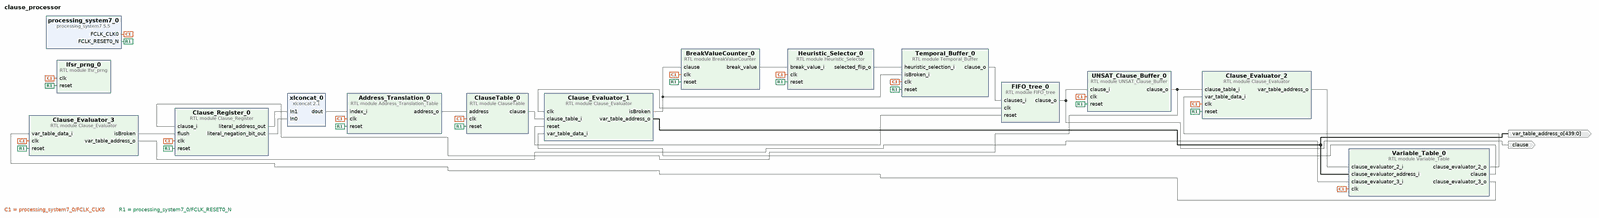
[diagram p0: block diagram of the top level, whole]
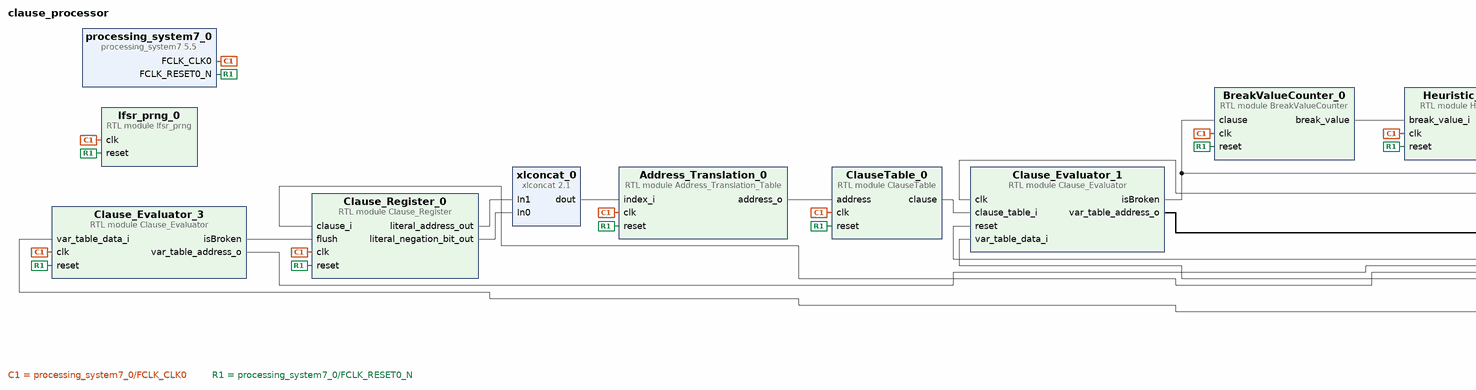
[diagram p1: block diagram of the top level, left part]
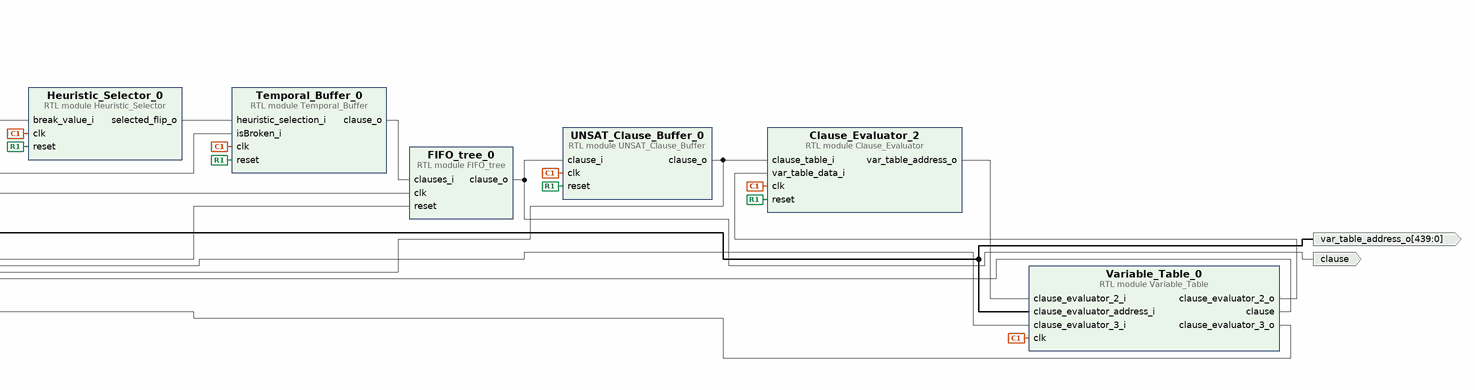
[diagram p2: block diagram of the top level, right part]
# Vivado block design clause_processor, xc7z020clg400-1, Vivado 2023.2
create_bd_design clause_processor

create_bd_port -dir O -from 439 -to 0 var_table_address_o
create_bd_port -dir O clause

create_bd_cell -type module -reference ClauseTable ClauseTable_0
create_bd_cell -type module -reference BreakValueCounter BreakValueCounter_0
create_bd_cell -type module -reference Clause_Evaluator Clause_Evaluator_1
create_bd_cell -type ip -vlnv xilinx.com:ip:processing_system7:5.5 processing_system7_0
create_bd_cell -type module -reference Heuristic_Selector Heuristic_Selector_0
create_bd_cell -type module -reference FIFO_tree FIFO_tree_0
create_bd_cell -type module -reference UNSAT_Clause_Buffer UNSAT_Clause_Buffer_0
create_bd_cell -type module -reference Variable_Table Variable_Table_0
create_bd_cell -type module -reference Clause_Register Clause_Register_0
create_bd_cell -type module -reference Clause_Evaluator Clause_Evaluator_2
set_property -dict {CONFIG.MAX_CLAUSES_PER_VARIABLE 1 CONFIG.NSAT 4} [get_bd_cells Clause_Evaluator_2]
create_bd_cell -type module -reference Clause_Evaluator Clause_Evaluator_3
set_property -dict {CONFIG.MAX_CLAUSES_PER_VARIABLE 1 CONFIG.NSAT 4} [get_bd_cells Clause_Evaluator_3]
create_bd_cell -type module -reference lfsr_prng lfsr_prng_0
create_bd_cell -type module -reference Address_Translation_Table Address_Translation_0
create_bd_cell -type ip -vlnv xilinx.com:ip:xlconcat:2.1 xlconcat_0
set_property -dict {CONFIG.IN0_WIDTH 1 CONFIG.IN1_WIDTH 11} [get_bd_cells xlconcat_0]
create_bd_cell -type module -reference Temporal_Buffer Temporal_Buffer_0

# ---- connections ----

connect_bd_net [get_bd_pins Address_Translation_0/address_o] [get_bd_pins ClauseTable_0/address]
connect_bd_net [get_bd_pins BreakValueCounter_0/break_value] [get_bd_pins Heuristic_Selector_0/break_value_i]
connect_bd_net [get_bd_pins ClauseTable_0/clause] [get_bd_pins Clause_Evaluator_1/clause_table_i]
connect_bd_net -net Clause_Evaluator_0_isBroken [get_bd_pins Clause_Evaluator_1/isBroken] \
  [get_bd_pins BreakValueCounter_0/clause] [get_bd_pins Temporal_Buffer_0/isBroken_i]
connect_bd_net -net Clause_Evaluator_0_var_table_address_o [get_bd_pins Clause_Evaluator_1/var_table_address_o] \
  [get_bd_pins Variable_Table_0/clause_evaluator_address_i] [get_bd_ports var_table_address_o]
connect_bd_net [get_bd_pins Clause_Evaluator_2/var_table_address_o] [get_bd_pins Variable_Table_0/clause_evaluator_2_i]
connect_bd_net [get_bd_pins Clause_Evaluator_3/isBroken] [get_bd_pins Clause_Register_0/flush]
connect_bd_net [get_bd_pins Clause_Evaluator_3/var_table_address_o] [get_bd_pins Variable_Table_0/clause_evaluator_3_i]
connect_bd_net [get_bd_pins Clause_Register_0/literal_address_out] [get_bd_pins xlconcat_0/In1]
connect_bd_net [get_bd_pins Clause_Register_0/literal_negation_bit_out] [get_bd_pins xlconcat_0/In0]
connect_bd_net [get_bd_pins FIFO_tree_0/clause_o] [get_bd_pins UNSAT_Clause_Buffer_0/clause_i] [get_bd_ports clause]
connect_bd_net [get_bd_pins Heuristic_Selector_0/selected_flip_o] [get_bd_pins Temporal_Buffer_0/heuristic_selection_i]
connect_bd_net [get_bd_pins Clause_Evaluator_1/clk] [get_bd_pins FIFO_tree_0/clk]
connect_bd_net [get_bd_pins Clause_Evaluator_1/reset] [get_bd_pins FIFO_tree_0/reset]
connect_bd_net [get_bd_pins Temporal_Buffer_0/clause_o] [get_bd_pins FIFO_tree_0/clauses_i]
connect_bd_net [get_bd_pins UNSAT_Clause_Buffer_0/clause_o] [get_bd_pins Clause_Register_0/clause_i] [get_bd_pins Clause_Evaluator_2/clause_table_i]
connect_bd_net -net Variable_Table_0_calause [get_bd_pins Variable_Table_0/clause] [get_bd_pins Clause_Evaluator_1/var_table_data_i]
connect_bd_net [get_bd_pins Variable_Table_0/clause_evaluator_2_o] [get_bd_pins Clause_Evaluator_2/var_table_data_i]
connect_bd_net [get_bd_pins Variable_Table_0/clause_evaluator_3_o] [get_bd_pins Clause_Evaluator_3/var_table_data_i]
connect_bd_net -net clk_1 [get_bd_pins processing_system7_0/FCLK_CLK0] \
  [get_bd_pins BreakValueCounter_0/clk] [get_bd_pins ClauseTable_0/clk] [get_bd_pins UNSAT_Clause_Buffer_0/clk] \
  [get_bd_pins Variable_Table_0/clk] [get_bd_pins lfsr_prng_0/clk] [get_bd_pins Address_Translation_0/clk] \
  [get_bd_pins Heuristic_Selector_0/clk] [get_bd_pins Clause_Register_0/clk] [get_bd_pins Clause_Evaluator_2/clk] \
  [get_bd_pins Clause_Evaluator_3/clk] [get_bd_pins Temporal_Buffer_0/clk]
connect_bd_net -net reset_0_1 [get_bd_pins processing_system7_0/FCLK_RESET0_N] \
  [get_bd_pins ClauseTable_0/reset] [get_bd_pins BreakValueCounter_0/reset] [get_bd_pins UNSAT_Clause_Buffer_0/reset] \
  [get_bd_pins lfsr_prng_0/reset] [get_bd_pins Address_Translation_0/reset] [get_bd_pins Heuristic_Selector_0/reset] \
  [get_bd_pins Clause_Register_0/reset] [get_bd_pins Clause_Evaluator_2/reset] [get_bd_pins Clause_Evaluator_3/reset] \
  [get_bd_pins Temporal_Buffer_0/reset]
connect_bd_net [get_bd_pins xlconcat_0/dout] [get_bd_pins Address_Translation_0/index_i]

validate_bd_design
save_bd_design
